# EAGLE design Zio Qwiic Level Translator PCA9306 (EAGLE 9.1.1)
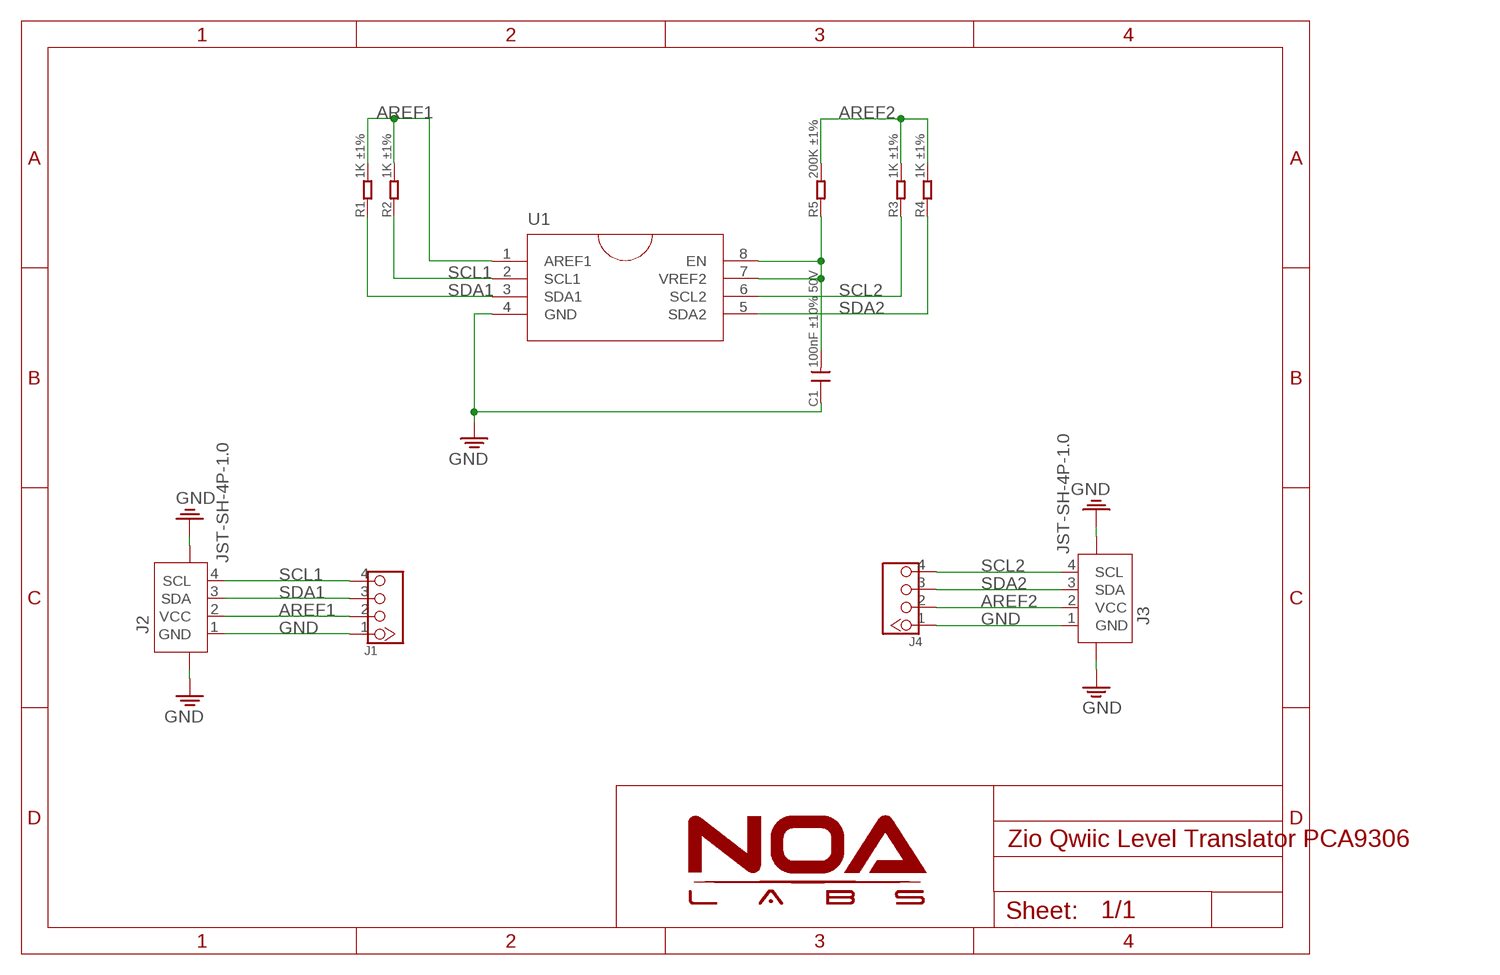
[diagram p0: schematic, sheet 1]

## Parts
C1  100nF ±10% 50V  C-0603  [C0603]
J1  HEADER-4P-60/35MIL  [4P-65/35MIL]
J2  JST-SH-4P-1.0  [JST-SH-4P]
J3  JST-SH-4P-1.0  [JST-SH-4P]
J4  HEADER-4P-60/35MIL  [4P-65/35MIL]
R1  1K ±1%  R-0603  [R0603]
R2  1K ±1%  R-0603  [R0603]
R3  1K ±1%  R-0603  [R0603]
R4  1K ±1%  R-0603  [R0603]
R5  200K ±1%  R-0603  [R0603]
U1  PCA9306DC  [VSSOP-8]

## Nets
AREF1: J1.2 J2.2(VCC) R1.2 R2.2 U1.1(AREF1)
AREF2: J3.2(VCC) J4.2 R3.2 R4.2 R5.2
GND: C1.1 J1.1 J2.1(GND) J2.NC1 J2.NC2 J3.1(GND) J3.NC1 J3.NC2 J4.1 U1.4(GND)
N$4: C1.2 R5.1 U1.7(VREF2) U1.8(EN)
SCL1: J1.4 J2.4(SCL) R2.1 U1.2(SCL1)
SCL2: J3.4(SCL) J4.4 R3.1 U1.6(SCL2)
SDA1: J1.3 J2.3(SDA) R1.1 U1.3(SDA1)
SDA2: J3.3(SDA) J4.3 R4.1 U1.5(SDA2)

## Library data of the parts
C1 = RCL:C
J1 J4 = Connector:HEADER-4P
J2 J3 = Connector:JST-SH-4P
R1-R5 = RCL:R
U1 = IC:PCA9306DC

## Board
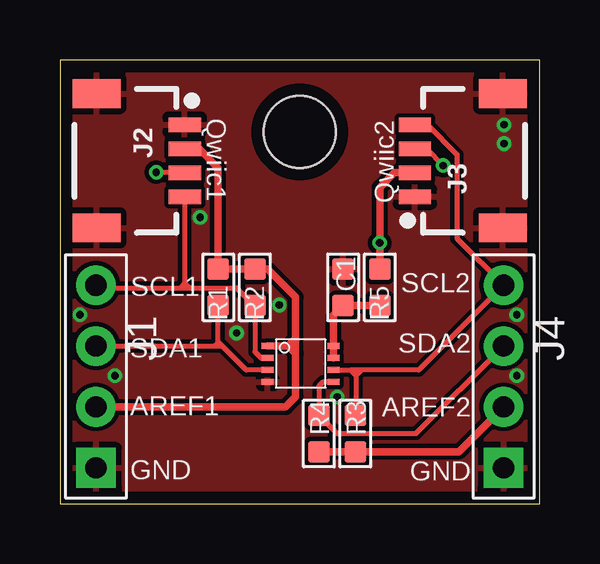
[diagram p1: board, top side]
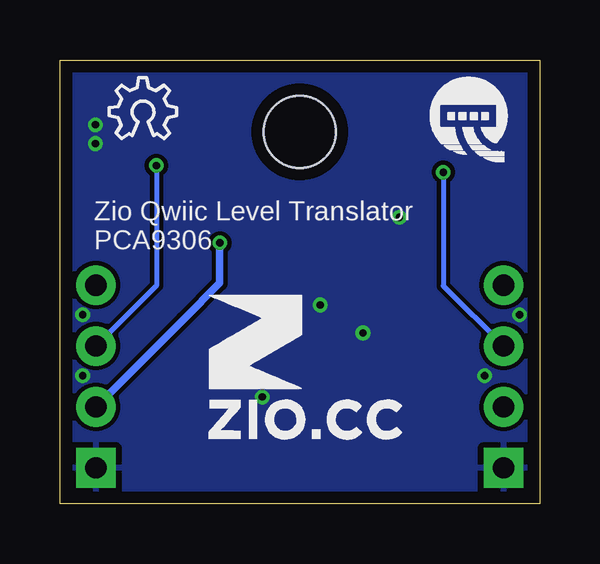
[diagram p2: board, bottom side, seen from below]

Size 20 x 18.5 mm. Coordinates in mm from the lower left corner, seen from the top.
Outline: 0,0 20,0 20,18.5 0,18.5 0,0
Copper layers (1*16): Top 0.035mm / dielectric 1.5mm / Bottom 0.035mm
Design rules "NOA Eagle Rule": minimum track width 7mil, minimum drill 12mil, track to track 7mil, track to pad 7mil, pad to pad 7mil, via to via 7mil, smd to smd 0mil, copper to edge 20mil, drill to drill 10mil, minimum pad ring 10mil, minimum via ring 6mil, stop-mask expansion 2mil, vias tented up to drill 25mil, thermal gap 10mil
Holes 3 mm at 10,15.5

### Footprints (pad centres in the part's own frame; a part is rotated, then mirrored left to right if it is on the bottom)
C0603 = smd 0.889 x 0.889: 1 -0.762,0; 2 0.762,0
4P-65/35MIL = drill 0.889 pad 1.651 square: 1 0,3.81 | drill 0.889 pad 1.651: 2 0,1.27; 3 0,-1.27; 4 0,-3.81
JST-SH-4P = smd 0.6 x 1.35: 1 1.5,0; 2 0.5,0; 3 -0.5,0; 4 -1.5,0 | smd 1.2 x 2: NC1 -2.8,3.675; NC2 2.8,3.675
R0603 = smd 0.889 x 0.889: 1 -0.762,0; 2 0.762,0
VSSOP-8 = smd 0.25 x 0.5: 1 -0.73,-1.37; 2 -0.23,-1.37; 3 0.27,-1.37; 4 0.77,-1.37; 5 0.77,1.38; 6 0.27,1.38; 7 -0.23,1.38; 8 -0.73,1.38

### Placement (x,y rotation side)
C1  11.81,9.02 270 top
J1  1.5,5.3 180 top
J2  5.2,14.3 90 top
J3  14.8,14.3 270 top
J4  18.5,5.3 180 top
R1  6.6,9.02 90 top
R2  8.13,9.02 90 top
R3  12.32,2.92 270 top
R4  10.79,2.92 270 top
R5  13.34,9.02 90 top
U1  10.03,5.84 270 top
U$1  [6MM]  13.82,2.69 0 bottom
U$2  [OSHW_6X100_NOTEXT]  17.96,15.21 0 bottom
U$3  [QWIIC-LOGO-BASIC]  3,16 0 bottom

### Tracks (layer width: path | path; a pad name or v marks a point on that pad's centre or on a via)
AREF1
  Top 0.305: J2.2 5.8,14.8 6.6,13.99 R1.2 R2.2 8.66,9.78 9.83,8.61 9.83,6.88 | 9.83,6.22 9.83,6.88 | U1.1 9.52,6.57 | 9.52,6.57 9.83,6.88 | 9.52,6.57 9.83,6.26 9.83,6.22 | J1.2 9.41,4.03 9.83,4.45 9.83,6.22
AREF2  (via drill 0.3)
  Top 0.305: J4.2 16.63,2.16 R3.2 R4.2 | J3.2 13.95,13.8 13.34,13.18 v13.34,10.87 R5.2
  Bottom 0.305: J4.2 14.85,7.68 13.34,9.2 v13.34,10.87
GND  (via drill 0.3)
  other vias: 2.29,5.33 0.84,7.87 7.37,7.11 5.84,11.94 19.05,5.33 19.05,7.87 11.56,4.45 9.14,8.28 18.52,15.8 18.52,15.01
  pour Bottom: 0,18.49 19.99,18.49 19.99,0 0,0
  pour Top: 0,18.49 19.99,18.49 19.99,0 0,0
N$4
  Top 0.305: U1.7 U1.8 11.41,7.86 C1.2 R5.1
SCL1
  Top 0.203: U1.2 8.38,6.07 8.13,6.33 R2.1 8.1,8.26 7.37,8.99 5.44,8.99 | J1.4 1.62,8.99 5,8.99 | 5,8.99 5.44,8.99 | J2.4 5.2,9.19 | 5.2,9.19 5,8.99 | 5.2,9.19 5.4,8.99 5.44,8.99
SCL2
  Top 0.203: U1.6 12.11,5.57 | 12.11,5.57 12.34,5.33 | 12.34,5.33 12.34,3.71 R3.1 | 12.57,5.57 14.96,5.57 J4.4 16.56,11.05 16.56,14.55 15.31,15.8 J3.4 | 12.57,5.57 12.11,5.57 | 12.34,5.33 12.57,5.56 12.57,5.57
SDA1  (via drill 0.3)
  Top 0.203: U1.3 7.76,5.57 6.76,6.58 | 6.6,6.73 R1.1 | 6.76,6.58 6.6,6.73 | J1.3 6.48,6.57 | 6.48,6.57 6.75,6.57 6.76,6.58 | 6.6,6.73 6.6,6.7 6.48,6.57 | J2.3 4.03,13.8 v4.01,13.82
  Bottom 0.203: v4.01,13.82 4.01,9.08 J1.3
SDA2  (via drill 0.3)
  Top 0.203: U1.5 10.96,5.07 10.79,4.9 R4.1 11.56,2.92 14.85,2.92 J4.3 | J3.3 15.27,14.8 v15.98,14.1
  Bottom 0.203: v15.98,14.1 15.98,9.09 J4.3

### Text on the board
tPlace: Qwiic1 | Qwiic2 | SCL2 | SCL1 | SDA2 | SDA1 | AREF1 | AREF2 | GND | GND
bPlace: Zio Qwiic Level Translator / PCA9306